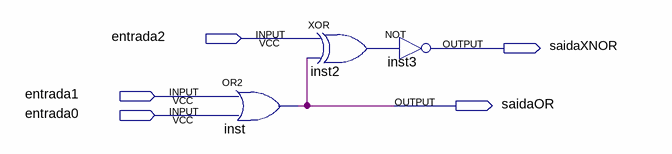
[diagram p0: schematic sheet]
// Quartus schematic orxnor.bdf as structural Verilog: 3 symbols, 5 pins
module orxnor (
  input  entrada2,
  input  entrada1,
  input  entrada0,
  output saidaXNOR,
  output saidaOR
);

  wire inst2_out;

  or inst (saidaOR, entrada1, entrada0);
  xor inst2 (inst2_out, entrada2, saidaOR);
  not inst3 (saidaXNOR, inst2_out);
endmodule
